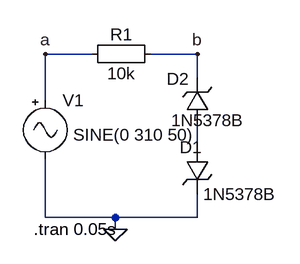
[diagram p0: schematic limiter_zener_two_sided.asc]
limiter_zener_two_sided.asc, the LTspice schematic file:
Version 4
SHEET 1 880 680
WIRE 16 112 -48 112
WIRE 160 112 96 112
WIRE 160 144 160 112
WIRE -48 176 -48 112
WIRE 160 240 160 208
WIRE -48 336 -48 256
WIRE 48 336 -48 336
WIRE 160 336 160 304
WIRE 160 336 48 336
WIRE 48 352 48 336
FLAG -48 112 a
FLAG 160 112 b
FLAG 48 352 0
SYMBOL zener 144 240 R0
WINDOW 0 -8 0 Left 2
SYMATTR InstName D1
SYMATTR Value 1N5378B
SYMATTR Description Diode
SYMATTR Type diode
SYMBOL Misc\\signal -48 160 R0
WINDOW 123 0 0 Left 2
WINDOW 39 0 0 Left 2
WINDOW 3 38 63 Left 2
SYMATTR Value SINE(0 310 50)
SYMATTR InstName V1
SYMBOL Misc\\EuropeanResistor 112 96 R90
WINDOW 0 5 56 VBottom 2
WINDOW 3 27 56 VTop 2
SYMATTR InstName R1
SYMATTR Value 10k
SYMBOL zener 176 208 R180
WINDOW 0 27 62 Left 2
WINDOW 3 -49 5 Left 2
SYMATTR InstName D2
SYMATTR Value 1N5378B
SYMATTR Description Diode
SYMATTR Type diode
TEXT -64 352 Left 2 !.tran 0.05s

The netlist it stands for:
* limiter_zener_two_sided.asc
D1 N001 0 1N5378B
V1 a 0 SINE(0 310 50)
R1 b a 10k
D2 N001 b 1N5378B
.model D D
.lib standard.dio
.tran 0.05s
.backanno
.end